# Altium schematic sheet USB_OTG.SchDoc: USB_OTG_HS
size A4; DocumentNumber: MB1165; Revision: C.1; SheetNumber: 8; SheetTotal: 17; Project: STM32469I-EVAL
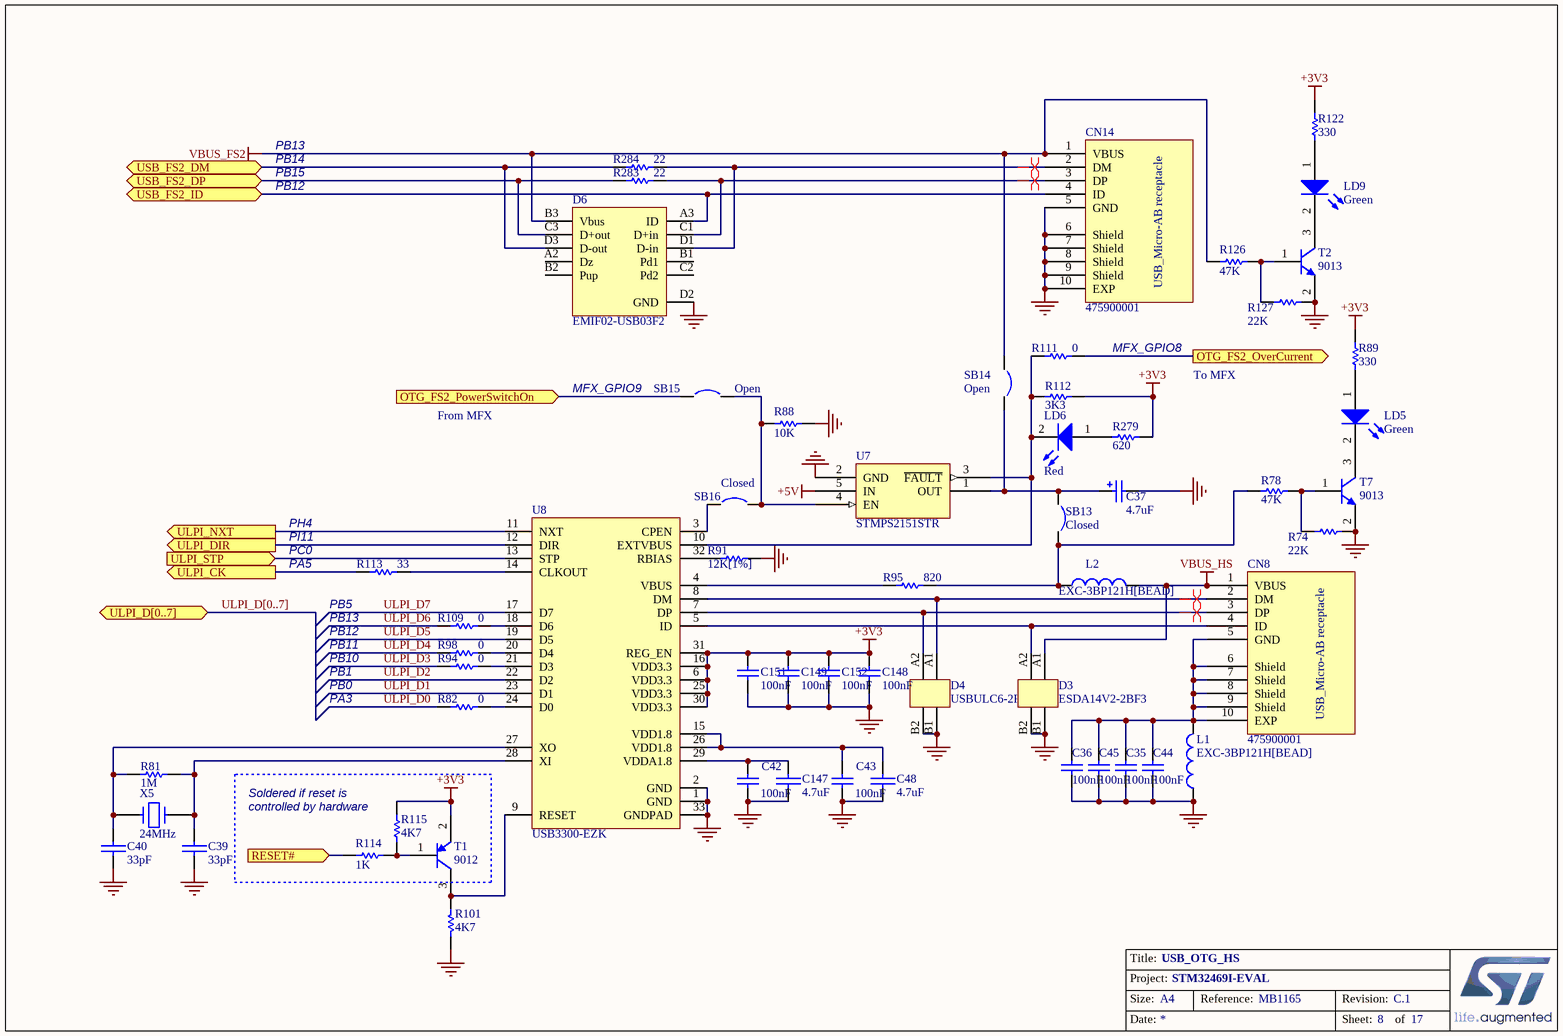
[diagram p0: USB_OTG.SchDoc]

## Parts
C35  100nF  [0603C]
C36  100nF  [0603C]
C37  4.7uF  [TAN-A]
C39  33pF  [0603C]
C40  33pF  [0603C]
C42  100nF  [0603C]
C43  100nF  [0603C]
C44  100nF  [0603C]
C45  100nF  [0603C]
C48  4.7uF  [TAN-A]
C147  4.7uF  [TAN-A]
C148  100nF  [0603C]
C149  100nF  [0603C]
C151  100nF  [0603C]
C152  100nF  [0603C]
CN8  475900001  [MOLEX_47590001]
CN14  475900001  [MOLEX_47590001]
D3  ESDA14V2-2BF3  [BGA4_0R4_0R8X0R8]
D4  USBULC6-2F3  [BGA4_0R4_1X1]
D6  EMIF02-USB03F2  [BGA11_0R5_1R57X2R07]
L1  EXC-3BP121H[BEAD]  [0603L]
L2  EXC-3BP121H[BEAD]  [0603L]
LD5  Green  [0603D]
LD6  Red  [0603D]
LD9  Green  [0603D]
R74  22K  [0603R]
R78  47K  [0603R]
R81  1M  [0603R]
R82  0  [0603R]
R88  10K  [0603R]
R89  330  [0603R]
R91  12K[1%]  [0603R]
R94  0  [0603R]
R95  820  [0603R]
R98  0  [0603R]
R101  4K7  [0603R]
R109  0  [0603R]
R111  0  [0603R]
R112  3K3  [0603R]
R113  33  [0603R]
R114  1K  [0603R]
R115  4K7  [0603R]
R122  330  [0603R]
R126  47K  [0603R]
R127  22K  [0603R]
R279  620  [0603R]
R283  22  [0603R]
R284  22  [0603R]
SB13  Closed  [SB_0603]
SB14  Open  [SB_0603]
SB15  Open  [SB_0603]
SB16  Closed  [SB_0603]
T1  9012  [SOT-23]
T2  9013  [SOT-23]
T7  9013  [SOT-23]
U7  STMPS2151STR  [SOT23-5]
U8  USB3300-EZK  [QFN32_0R5_5X5]
X5  24MHz  [XTAL1]

## Ports
OTG_FS2_OverCurrent (out), OTG_FS2_PowerSwitchOn (in), RESET# (in), ULPI_CK (out), ULPI_D[0..7] (bidir), ULPI_DIR (out), ULPI_NXT (out), ULPI_STP (in), USB_FS2_DM (bidir), USB_FS2_DP (bidir), USB_FS2_ID (bidir)

## Nets
+3V3: C148.1 C149.1 C151.1 C152.1 R89.2 R112.1 R115.1 R122.2 R279.2 T1.2(E) U8.6(VDD3.3) U8.16(VDD3.3) U8.25(VDD3.3) U8.30(VDD3.3) U8.31(REG_EN)
+5V: U7.5(IN)
GND: C35.2 C36.2 C37.2 C39.2 C40.2 C42.2 C43.2 C44.2 C45.2 C48.2 C147.2 C148.2 C149.2 C151.2 C152.2 CN14.5(GND) CN14.6(Shield) CN14.7(Shield) CN14.8(Shield) CN14.9(Shield) CN14.10(EXP) D3.B1 D3.B2 D4.B1 D4.B2 D6.D2(GND) L1.1 R74.1 R88.1 R91.1 R101.1 R127.1 T2.2(E) T7.2(E) U7.2(GND) U8.1(GND) U8.2(GND) U8.33(GNDPAD)
VBUS_FS2: CN14.1(VBUS) D6.B3(Vbus) R126.1 SB14.1
VBUS_HS: CN8.1(VBUS) D3.A1 L2.2
OTG_FS2_OverCurrent: R111.1 ; port OTG_FS2_OverCurrent
OTG_FS2_PowerSwitchOn: SB15.1 ; port OTG_FS2_PowerSwitchOn
RESET#: R114.2 ; port RESET#
ULPI_CK: R113.2 ; port ULPI_CK
ULPI_D0: R82.2
ULPI_D1: U8.23(D1)
ULPI_D2: U8.22(D2)
ULPI_D3: R94.2
ULPI_D4: R98.2
ULPI_D5: U8.19(D5)
ULPI_D6: R109.2
ULPI_D7: U8.17(D7)
ULPI_DIR: U8.12(DIR) ; port ULPI_DIR
ULPI_NXT: U8.11(NXT) ; port ULPI_NXT
ULPI_STP: U8.13(STP) ; port ULPI_STP
USB_FS2_DM: D6.D3(D-out) R284.2 ; port USB_FS2_DM
USB_FS2_DP: D6.C3(D+out) R283.2 ; port USB_FS2_DP
USB_FS2_ID: CN14.4(ID) D6.A3(ID) ; port USB_FS2_ID
NetC35_1: C35.1 C36.1 C44.1 C45.1 CN8.5(GND) CN8.6(Shield) CN8.7(Shield) CN8.8(Shield) CN8.9(Shield) CN8.10(EXP) L1.2
NetC37_1: C37.1 SB13.1 SB14.2 U7.1(OUT)
NetC39_1: C39.1 R81.2 U8.28(XI) X5.1
NetC40_1: C40.1 R81.1 U8.27(XO) X5.2
NetC42_1: C42.1 C147.1 U8.29(VDDA1.8)
NetC43_1: C43.1 C48.1 U8.15(VDD1.8) U8.26(VDD1.8)
NetCN8_2: CN8.2(DM) D4.A1 U8.8(DM)
NetCN8_3: CN8.3(DP) D4.A2 U8.7(DP)
NetCN8_4: CN8.4(ID) D3.A2 U8.5(ID)
NetCN14_2: CN14.2(DM) D6.D1(D-in) R284.1
NetCN14_3: CN14.3(DP) D6.C1(D+in) R283.1
NetL2_1: L2.1 R78.2 R95.2 SB13.2
NetLD5_1: LD5.1(A) R89.1
NetLD5_2: LD5.2(K) T7.3(C)
NetLD6_1: LD6.1(A) R279.1
NetLD6_2: LD6.2(K) R111.2 R112.2 U7.3(~{FAULT}) U8.10(EXTVBUS)
NetLD9_1: LD9.1(A) R122.1
NetLD9_2: LD9.2(K) T2.3(C)
NetR74_2: R74.2 R78.1 T7.1(B)
NetR82_1: R82.1 U8.24(D0)
NetR88_2: R88.2 SB15.2 SB16.2 U7.4(EN)
NetR91_2: R91.2 U8.32(RBIAS)
NetR94_1: R94.1 U8.21(D3)
NetR95_1: R95.1 U8.4(VBUS)
NetR98_1: R98.1 U8.20(D4)
NetR101_2: R101.2 T1.3(C) U8.9(RESET)
NetR109_1: R109.1 U8.18(D6)
NetR113_1: R113.1 U8.14(CLKOUT)
NetR114_1: R114.1 R115.2 T1.1(B)
NetR126_2: R126.2 R127.2 T2.1(B)
NetSB16_1: SB16.1 U8.3(CPEN)

Not connected (* = marked no-connect by the designer): D6 A2(Dz) B1(Pd1) B2(Pup) C2(Pd2)

## Buses and harness runs
bus ULPI_D[0..7] = port ULPI_D[0..7]

## Layout directives
differential pair: NetCN8_2, NetCN8_3, NetCN14_2, NetCN14_3

## Notes on the sheet
- PB13
- PB14
- PB15
- PB12
- MFX_GPIO8
- To MFX
- From MFX
- MFX_GPIO9
- PH4
- PI11
- PC0
- PA5
- PB11
- (near R113) PB13
- (near R113) PB5
- PA3
- PB0
- PB1
- PB10
- (near R115) Soldered if reset is
- (near R115) controlled by hardware
- Title:
- Project:
- Size:
- Date:
- A4
- Reference:
- Sheet:
- Revision:
- of
- (in symbol 475900001) USB_Micro-AB receptacle

## Library data of the parts
C35 C36 C42-C45 C148 C149 C151 C152 = Cap: Capacitor; Value: 10nF; Published: 8-Jun-2000; Revision: July-2002: Re-released for DXP Platform.; Publisher: Altium Limited
C37 = Cap Pol1: Polarized Capacitor (Radial); Value: 47uF; Published: 8-Jun-2000; Revision: July-2002: Re-released for DXP Platform.; Publisher: Altium Limited
C39 C40 C48 C147 = CAP: Capacitor
L1 L2 = Inductor: Value: 100uH; Published: 8-Jun-2000; Revision: July-2002: Re-released for DXP Platform.; Publisher: Altium Limited
LD5 LD6 LD9 = LED2: Typical RED, GREEN, YELLOW, AMBER GaAs LED; Published: 8-Jun-2000; Revision: July-2002: Re-released for DXP Platform.; Publisher: Altium Limited
R74 R78 R88 R89 R95 R112 R122 R126 R127 = res1: Resistor; Value: 1K; Published: 8-Jun-2000; Revision: July-2002: Re-released for DXP Platform.; Publisher: Altium Limited
R81 R82 R91 R94 R98 R101 R109 R111 R113 R115 R279 R283 R284 = Res1: Resistor; Value: 1K; Published: 8-Jun-2000; Revision: July-2002: Re-released for DXP Platform.; Publisher: Altium Limited
R114 = Res1: Resistor; Published: 8-Jun-2000; Revision: July-2002: Re-released for DXP Platform.; Publisher: Altium Limited; Value: 1K
SB13 SB16 = Circuit Breaker_close: Circuit Breaker; Published: 24-Mar-1999; Revision: July-2002: Re-released for DXP Platform.; Publisher: Altium Limited
SB14 SB15 = Circuit Breaker: Published: 24-Mar-1999; Revision: July-2002: Re-released for DXP Platform.; Publisher: Altium Limited
T1 = PNP: PNP Bipolar Transistor; Published: 8-Jun-2000; Revision: July-2002: Re-released for DXP Platform.; Publisher: Altium Limited; Code - JEDEC: SOT-23
T2 T7 = NPN: NPN Bipolar Transistor; Code - JEDEC: TO-226-AA; Published: 8-Jun-2000; Revision: July-2002: Re-released for DXP Platform.; Publisher: Altium Limited
U7 = STMPS2141STR
X5 = CRYSTAL